# EAGLE design HAB1 Schematic (EAGLE 7.2.0)
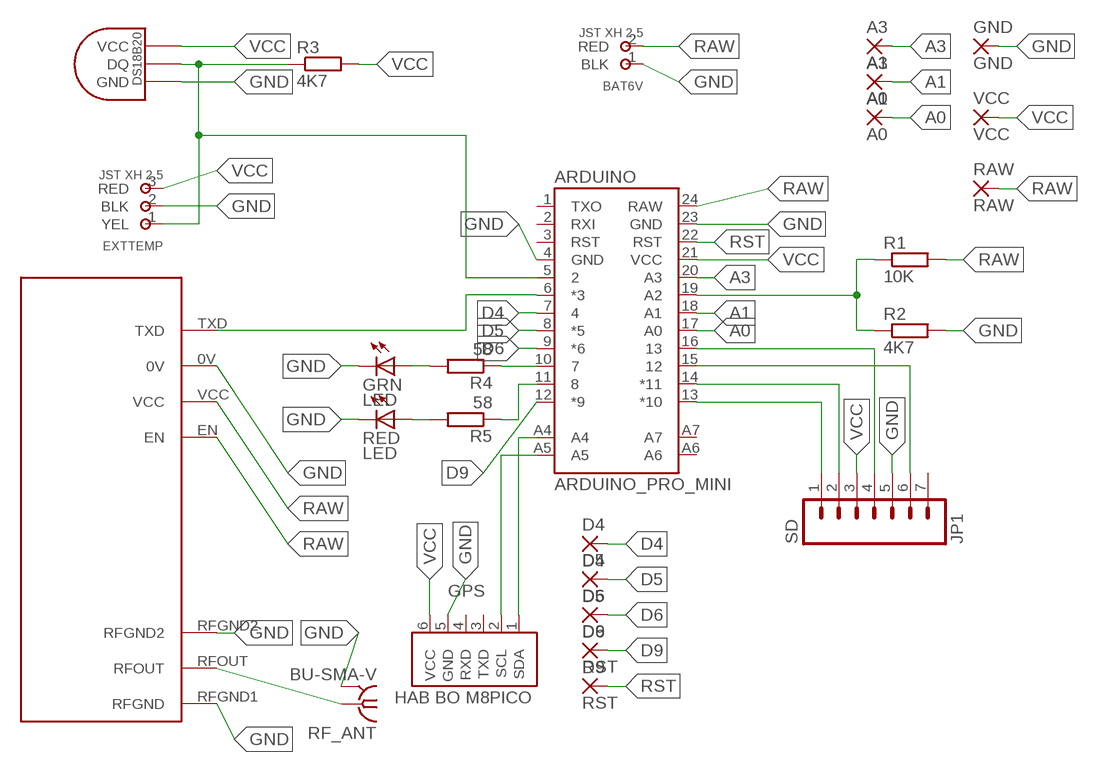
[diagram p0: schematic, sheet 1]

## Parts
A0  A0  1,6/0,8  [1,6/0,8]
A1  A1  1,6/0,8  [1,6/0,8]
A3  A3  1,6/0,8  [1,6/0,8]
ARDUINO  ARDUINO_PRO_MINI  [ARDUINO_PRO_MINI]
BAT6V  JST-XH-2.5-2PIN-MAIL  [JST-XH-2.5-2PIN-MAILE]
D4  D4  1,6/0,8  [1,6/0,8]
D5  D5  1,6/0,8  [1,6/0,8]
D6  D6  1,6/0,8  [1,6/0,8]
D9  D9  1,6/0,8  [1,6/0,8]
EXTTEMP  JST-XH-2.5-2PIN-MAIL  [JST-XH-2.5-2PIN-MAILE]
GND  GND  1,6/0,8  [1,6/0,8]
GPS  HAB-BO-M8PICONORMAL  [HAB-BO-M8PICO]
GRN  LED  LED3MM  [LED3MM]
INT  DS1820TO92  [DS1820]
JP1  SD  M07  [1X07]
R1  10K  R-EU_0204/5  [0204/5]
R2  4K7  R-EU_0204/5  [0204/5]
R3  4K7  R-EU_0204/5  [0204/5]
R4  58  R-EU_0204/5  [0204/5]
R5  58  R-EU_0204/5  [0204/5]
RAW  RAW  1,6/0,8  [1,6/0,8]
RED  LED  LED3MM  [LED3MM]
RF_ANT  BU-SMA-V  [BU-SMA-V]
RST  RST  1,6/0,8  [1,6/0,8]
U$3  NTX2-VERTICAL  [NTX2-VERTICAL]
VCC  VCC  1,6/0,8  [1,6/0,8]

## Nets
A0: A0.1(P) ARDUINO.17(A0)
A1: A1.1(P) ARDUINO.18(A1)
A2: ARDUINO.19(A2) R1.1 R2.1
A3: A3.1(P) ARDUINO.20(A3)
D2: ARDUINO.5 EXTTEMP.1(YEL) INT.DQ R3.1
D4: ARDUINO.7 D4.1(P)
D5: ARDUINO.8(*5) D5.1(P)
D6: ARDUINO.9(*6) D6.1(P)
D9: ARDUINO.12(*9) D9.1(P)
GND: ARDUINO.4(GND) ARDUINO.23(GND) BAT6V.1(BLK) EXTTEMP.2(BLK) GND.1(P) GPS.5(GND) GRN.K(C) INT.GND JP1.5 R2.2 RED.K(C) RF_ANT.2 RF_ANT.3 RF_ANT.4 RF_ANT.5 U$3.0V U$3.RFGND1(RFGND) U$3.RFGND2
N$1: ARDUINO.13(*10) JP1.1
N$2: ARDUINO.10 R4.1
N$3: GRN.A R4.2
N$4: ARDUINO.11 R5.1
N$5: R5.2 RED.A
N$6: ARDUINO.6(*3) U$3.TXD
N$8: ARDUINO.A5 GPS.2(SCL)
N$19: ARDUINO.15 JP1.6
N$20: ARDUINO.14(*11) JP1.2
N$21: ARDUINO.16 JP1.4
N$50: ARDUINO.A4 GPS.1(SDA)
RAW: ARDUINO.24(RAW) BAT6V.2(RED) R1.2 RAW.1(P) U$3.EN U$3.VCC
RFSIGNAL [RF signal]: RF_ANT.1 U$3.RFOUT
RST: ARDUINO.22(RST) RST.1(P)
VCC: ARDUINO.21(VCC) EXTTEMP.3(RED) GPS.6(VCC) INT.VDD(VCC) JP1.3 R3.2 VCC.1(P)
Unconnected: ARDUINO.1(TXO) ARDUINO.2(RXI) ARDUINO.3(RST) ARDUINO.A6 ARDUINO.A7 GPS.3(TXD) GPS.4(RXD) JP1.7

## Library data of the parts
A0 A1 A3 D4-D6 D9 GND RAW RST VCC = wirepad:1,6/0,8: THROUGH-HOLE PAD
ARDUINO = SparkFun-Boards:ARDUINO_PRO_MINI
BAT6V = JST XH 2.5 2 Pin Male:JST-XH-2.5-2PIN-MAIL: JST XH 2.5 2 Pin Male Connector. 2 pins at 2.54mm spacing. 7.5mm x 7.1mm footprint .
EXTTEMP = JST XH 2.5 3 Pin Male:JST-XH-2.5-2PIN-MAIL: JST XH 2.5 3 Pin Male Connector. 3 pins at 2.54mm spacing. 10mm x 6mm footprint .
GPS = HAB-BO-M8PICO:HAB-BO-M8PICO: HAB Supplies uBlox M8C Pico breakout board (product code HAB-BO-M8PICO-ASSY).
GRN RED = led:LED: LED OSRAM: - CHIPLED LG R971, LG N971, LY N971, LG Q971, LY Q971, LO R971, LY R971 LH N974, LH R974 LS Q976, LO Q976, LY Q976 LO Q996 - Hyper CHIPLED LW Q18S LB Q993, LB Q99A, LB R99A - SideLED LS A670, LO A670, LY A670, LG A670, LP A670 LB A673, LV A673, LT A673, LW A673 LH A674 LY A675 LS A676, LA A676, LO A676, LY A676, LW A676 LS A679, LY A679, LG A679 - Hyper Micro SIDELED® LS Y876, LA Y876, LO Y876, LY Y876 LT Y87S - SmartLED LW L88C, LW L88S LB L89C, LB L89S, LG L890 LS L89K, LO L89K, LY L89K LS L896, LA L896, LO L896, LY L896 - TOPLED LS T670, LO T670, LY T670, LG T670, LP T670 LSG T670, LSP T670, LSY T670, LOP T670, LYG T670 LG T671, LOG T671, LSG T671 LB T673, LV T673, LT T673, LW T673 LH T674 LS T676, LA T676, LO T676, LY T676, LB T676, LH T676, LSB T676, LW T676 LB T67C, LV T67C, LT T67C, LS T67K, LO T67K, LY T67K, LW E67C LS E67B, LA E67B, LO E67B, LY E67B, LB E67C, LV E67C, LT E67C LW T67C LS T679, LY T679, LG T679 LS T770, LO T770, LY T770, LG T770, LP T770 LB T773, LV T773, LT T773, LW T773 LH T774 LS E675, LA E675, LY E675, LS T675 LS T776, LA T776, LO T776, LY T776, LB T776 LHGB T686 LT T68C, LB T68C - Hyper Mini TOPLED® LB M676 - Mini TOPLED Santana® LG M470 LS M47K, LO M47K, LY M47K Source: http://www.osram.convergy.de LUXEON: - LUMILED® LXK2-PW12-R00, LXK2-PW12-S00, LXK2-PW14-U00, LXK2-PW14-V00 LXK2-PM12-R00, LXK2-PM12-S00, LXK2-PM14-U00 LXK2-PE12-Q00, LXK2-PE12-R00, LXK2-PE12-S00, LXK2-PE14-T00, LXK2-PE14-U00 LXK2-PB12-K00, LXK2-PB12-L00, LXK2-PB12-M00, LXK2-PB14-N00, LXK2-PB14-P00, LXK2-PB14-Q00 LXK2-PR12-L00, LXK2-PR12-M00, LXK2-PR14-Q00, LXK2-PR14-R00 LXK2-PD12-Q00, LXK2-PD12-R00, LXK2-PD12-S00 LXK2-PH12-R00, LXK2-PH12-S00 LXK2-PL12-P00, LXK2-PL12-Q00, LXK2-PL12-R00 Source: www.luxeon.com KINGBRIGHT: KA-3528ASYC Source: www.kingbright.com
INT = Ava:DS1820: DS18B20 Programmable Resolution 1-Wire Digital Thermometer Description The DS18B20 digital thermometer provides 9-bit to 12-bit Celsius temperature measurements and has an alarm function with nonvolatile user-programmable upper and lower trigger points. The DS18B20 communicates over a 1-Wire® bus that by definition requires only one data line (and ground) for communication with a central microprocessor. It has an operating temperature range of -55°C to +125°C and is accurate to ±0.5°C over the range of -10°C to +85°C. In addition, the DS18B20 can derive power directly from the data line ("parasite power"), eliminating the need for an external power supply. Each DS18B20 has a unique 64-bit serial code, which allows multiple DS18B20s to function on the same 1-Wire bus. Thus, it is simple to use one microprocessor to control many DS18B20s distributed over a large area. Applications that can benefit from this feature include HVAC environmental controls, temperature monitoring systems inside buildings, equipment, or machinery, and process monitoring and control systems.
JP1 = SparkFun:M07: Header 7 Standard 7-pin 0.1" header. Use with straight break away headers (SKU : PRT-00116), right angle break away headers (PRT-00553), swiss pins (PRT-00743), machine pins (PRT-00117), and female headers (PRT-00115). NOTES ON THE VARIANTS LOCK and LOCK_LONGPADS... This footprint was designed to help hold the alignment of a through-hole component (i.e. 7-pin header) while soldering it into place. You may notice that each hole has been shifted either up or down by 0.005 of an inch from it's more standard position (which is usually a perfectly straight line). This slight alteration caused the pins (the squares in the middle) to touch the edges of the holes. Because they are alternating, it causes a "brace" to hold the header in place. 0.005 has proven to be the perfect amount of "off-center" position when using our standard breakaway headers. Although looks a little odd when you look at the bare footprint, once you have a header in there, the alteration is very hard to notice. Also, if you push a header all the way into place, it is covered up entirely on the bottom side. This idea of altering the position of holes to aid alignment will be further integrated into the Sparkfun Library for other footprints. It can help hold any component with 3 or more connection pins.
R1-R5 = rcl:R-EU_: RESISTOR, European symbol
RF_ANT = con-coax:BU-SMA-V: FEMALE SMA CONNECTOR Radiall distributor RS 112-3794; OC_FARNELL: unknown; OC_NEWARK: unknown
U$3 = Ava:NTX2-VERTICAL: Radiometrix NTX2 Transmitter Module Author Anthony Stirk / http://ava.upuaut.net

## Net classes
1 RF signal: width 0.5 mm

## Board
HabTracker V1. Designed by infaddict.
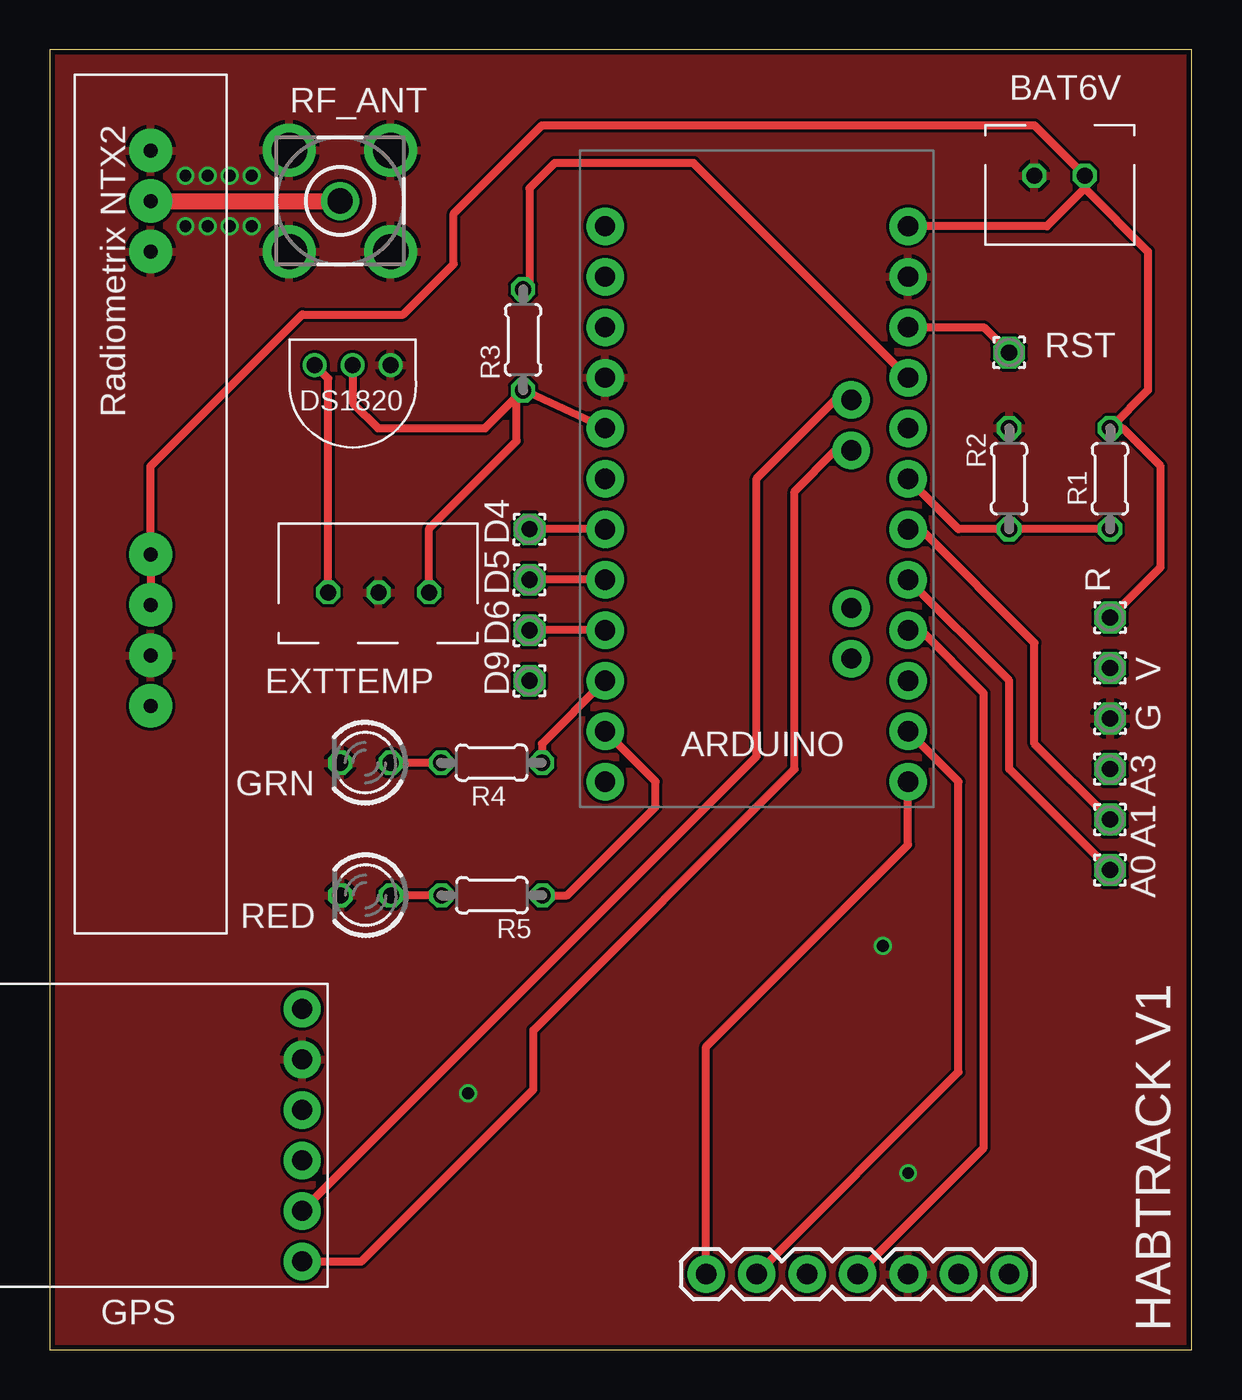
[diagram p1: board, top side]
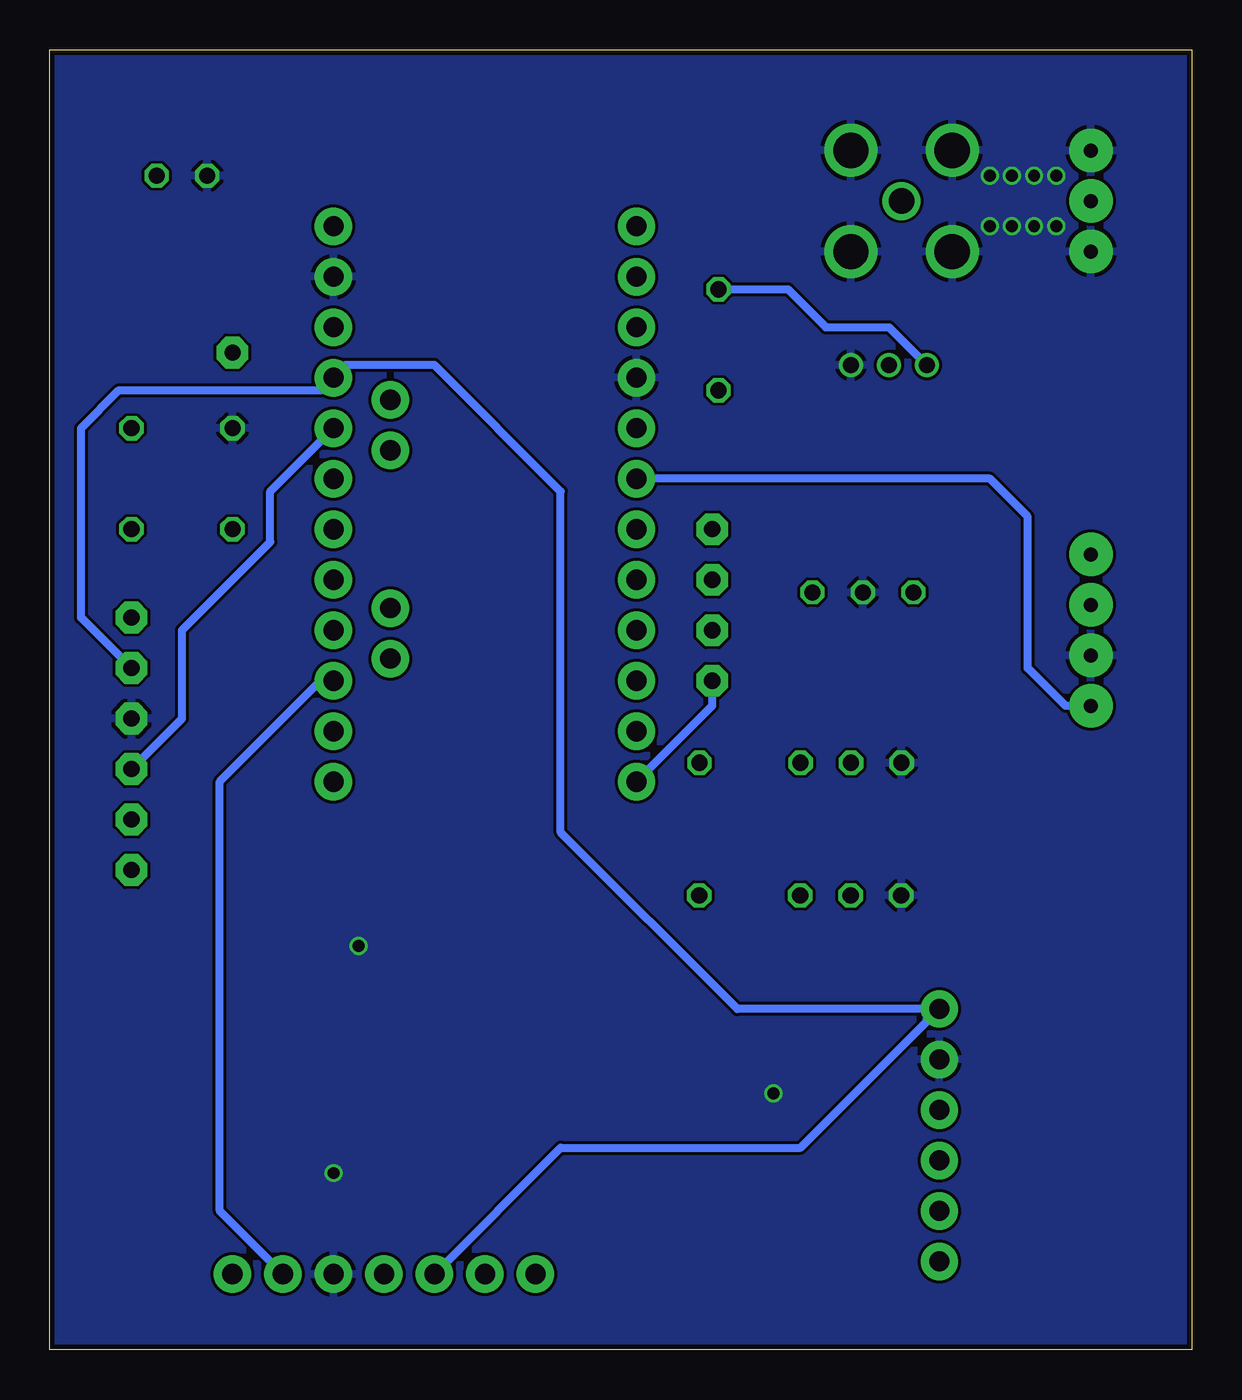
[diagram p2: board, bottom side, seen from below]

Size 57.45 x 65.4 mm. Coordinates in mm from the lower left corner, seen from the top.
Outline: 0,0 57.45,0 57.45,65.4 0,65.4 0,0
Copper layers (1*16): Top 0.018mm / dielectric 1.55mm / Bottom 0.018mm
Design rules "eC_2Layer_PClass6_BaseCopperO18_eCDefault": minimum track width 0.15mm, minimum drill 0.35mm, track to track 0.15mm, track to pad 0.15mm, pad to pad 0.15mm, via to via 0.15mm, smd to smd 0mil, copper to edge 0.25mm, drill to drill 0.35mm, minimum pad ring 0.175mm, minimum via ring 0.125mm, stop-mask expansion 0mil, vias tented up to drill 0.45mm, thermal gap 0.2mm

### Footprints (pad centres in the part's own frame; a part is rotated, then mirrored left to right if it is on the bottom)
1,6/0,8 = drill 0.813 pad 1.6 octagon: 1 0,0
ARDUINO_PRO_MINI = drill 1.016 pad 1.88: 1 -7.62,12.7; 2 -7.62,10.16; 3 -7.62,7.62; 4 -7.62,5.08; 5 -7.62,2.54; 6 -7.62,0; 7 -7.62,-2.54; 8 -7.62,-5.08; 9 -7.62,-7.62; 10 -7.62,-10.16; 11 -7.62,-12.7; 12 -7.62,-15.24; 13 7.62,-15.24; 14 7.62,-12.7; 15 7.62,-10.16; 16 7.62,-7.62; 17 7.62,-5.08; 18 7.62,-2.54; 19 7.62,0; 20 7.62,2.54; 21 7.62,5.08; 22 7.62,7.62; 23 7.62,10.16; 24 7.62,12.7; A4 4.763,1.429; A5 4.763,3.969; A6 4.763,-9.049; A7 4.763,-6.509
JST-XH-2.5-2PIN-MAILE = drill 0.8 octagon: 1 -2.54,-2.54; 2 0,-2.54
JST-XH-2.5-2PIN-MAILE' = drill 0.8 octagon: 1 -2.58,-2.54; 2 -0.04,-2.54; 3 2.5,-2.54
HAB-BO-M8PICO = drill 1.016 pad 1.88: 1 -5.08,-8.89; 2 -2.54,-8.89; 3 0,-8.89; 4 2.54,-8.89; 5 5.08,-8.89; 6 7.62,-8.89
LED3MM = drill 0.813 octagon: A -1.27,0; K 1.27,0
DS1820 = drill 0.8: DQ 2.54,-1.27; GND 0.635,-1.27; VDD 4.445,-1.27
1X07 = drill 1.016 pad 1.88: 1 0,0; 2 2.54,0; 3 5.08,0; 4 7.62,0; 5 10.16,0; 6 12.7,0; 7 15.24,0
0204/5 = drill 0.813 octagon: 1 -2.54,0; 2 2.54,0
BU-SMA-V = drill 1.27: 1 0,0 | drill 1.778: 2 -2.55,2.55; 3 2.55,2.55; 4 2.55,-2.55; 5 -2.55,-2.55
NTX2-VERTICAL = drill 0.7 pad 2.184: 0V 17.78,0; EN 12.7,0; RFGND1 -7.62,0; RFGND2 -2.54,0; RFOUT -5.08,0; TXD 20.32,0; VCC 15.24,0

### Placement (x,y rotation side)
A0  53.34,24.13 270 top
A1  53.34,26.67 270 top
A3  53.34,29.21 270 top
ARDUINO  35.56,43.81 0 top
BAT6V  52.07,61.6 0 top
D4  24.13,41.27 90 top
D5  24.13,38.73 90 top
D6  24.13,36.2 90 top
D9  24.13,33.66 90 top
EXTTEMP  JST-XH-2.5-2PIN-MAIL  [JST-XH-2.5-2PIN-MAILE']  16.51,35.56 180 top
GND  53.34,31.75 90 top
GPS  3.81,9.53 90 top
GRN  15.88,29.53 180 top
INT  17.78,48.26 180 top
JP1  33.02,3.81 0 top
R1  53.34,43.81 90 top
R2  48.26,43.81 90 top
R3  23.81,50.8 90 top
R4  22.23,29.53 180 top
R5  22.25,22.86 180 top
RAW  53.34,36.83 90 top
RED  15.89,22.86 180 top
RF_ANT  14.61,57.78 0 top
RST  48.26,50.16 0 top
U$3  5.08,52.7 270 top
VCC  53.34,34.29 270 top

### Tracks (layer width: path | path; a pad name or v marks a point on that pad's centre or on a via)
A0
  Top 0.406: ARDUINO.17 48.26,33.66 48.26,29.21 A0.1
A1
  Top 0.406: ARDUINO.18 43.81,41.27 49.53,35.56 49.53,30.48 A1.1
A2
  Top 0.406: R1.1 R2.1 45.72,41.27 ARDUINO.19
A3
  Bottom 0.406: A3.1 50.8,31.75 50.8,36.2 46.35,40.64 46.35,43.18 ARDUINO.20
D2
  Top 0.406: ARDUINO.5 R3.1 | INT.DQ 15.24,47.62 16.51,46.35 21.91,46.35 R3.1 | EXTTEMP.1 19.09,41.31 23.5,45.72 23.5,47.94 R3.1
D4
  Top 0.406: ARDUINO.7 D4.1
D5
  Top 0.406: ARDUINO.8 D5.1
D6
  Top 0.406: ARDUINO.9 D6.1
D9
  Bottom 0.406: D9.1 24.13,32.38 ARDUINO.12
GND  (via drill 0.6)
  other vias: 41.91,20.32 43.18,8.89 6.83,59.05 7.94,59.05 6.83,56.52 7.94,56.52 9.05,59.05 9.05,56.52 10.16,59.05 10.16,56.53 21.05,12.89
  pour Bottom: -5.08,71.75 71.75,71.75 71.75,-3.18 -5.08,-3.18
  pour Top: -2.54,69.22 69.85,69.22 69.85,-1.27 -2.54,-1.27
N$1
  Top 0.406: JP1.1 33.02,15.24 43.18,25.4 ARDUINO.13
N$2
  Top 0.406: ARDUINO.10 24.77,30.48 R4.1
N$3
  Top 0.406: R4.2 GRN.A
N$4
  Top 0.406: R5.1 26.04,22.86 30.48,27.3 30.48,28.58 ARDUINO.11
N$5
  Top 0.406: R5.2 RED.A
N$6
  Bottom 0.406: U$3.TXD 6.35,32.38 8.26,34.29 8.26,41.91 10.16,43.81 ARDUINO.6
N$8
  Top 0.406: GPS.2 35.56,29.84 35.56,43.81 39.53,47.78 ARDUINO.A5
N$19
  Bottom 0.406: JP1.6 48.9,6.98 48.9,28.58 43.81,33.66 ARDUINO.15
N$20
  Top 0.406: JP1.2 45.72,13.97 45.72,28.58 ARDUINO.14
N$21
  Top 0.406: JP1.4 46.99,10.16 46.99,33.02 43.81,36.2 ARDUINO.16
N$50
  Top 0.406: ARDUINO.A4 39.53,45.24 37.47,43.18 37.47,29.21 24.33,16.08 24.33,13.09 15.68,4.45 GPS.1
RAW
  Top 0.406: 52.07,58.42 BAT6V.2 49.53,61.6 24.77,61.6 20.32,57.15 20.32,54.61 17.78,52.07 12.7,52.07 5.08,44.45 U$3.EN U$3.VCC | 52.07,58.42 55.24,55.24 55.24,48.26 R1.2 53.98,46.35 55.88,44.45 55.88,39.37 RAW.1 | 52.07,58.42 50.16,56.52 ARDUINO.24
RFSIGNAL
  Top 0.813: U$3.RFOUT RF_ANT.1
RST
  Top 0.406: ARDUINO.22 46.99,51.44 RST.1
VCC
  Top 0.406: EXTTEMP.3 14.01,48.85 INT.VDD | ARDUINO.21 32.38,59.69 25.4,59.69 24.13,58.42 24.13,53.66 R3.2
  Bottom 0.406: R3.2 20.32,53.34 18.41,51.44 15.24,51.44 INT.VDD | GPS.6 13.34,17.14 | 13.34,17.14 22.86,17.14 31.75,26.04 31.75,43.18 38.1,49.53 42.55,49.53 ARDUINO.21 43.81,48.26 53.98,48.26 55.88,46.35 55.88,36.83 VCC.1 | JP1.3 31.75,10.16 19.68,10.16 13.34,16.51 13.34,17.14

### Text on the board
tPlace: R | V | G | HABTRACK V1
mfgcode: XxXxXxXxXxXx